# Altium schematic sheet Output1-12.SchDoc
size 594 x 420 mm; SheetNumber: 7; SheetTotal: 10; Обозначение документа: QFP output1-12; Номер листа: 7; Общее количество листов: 10
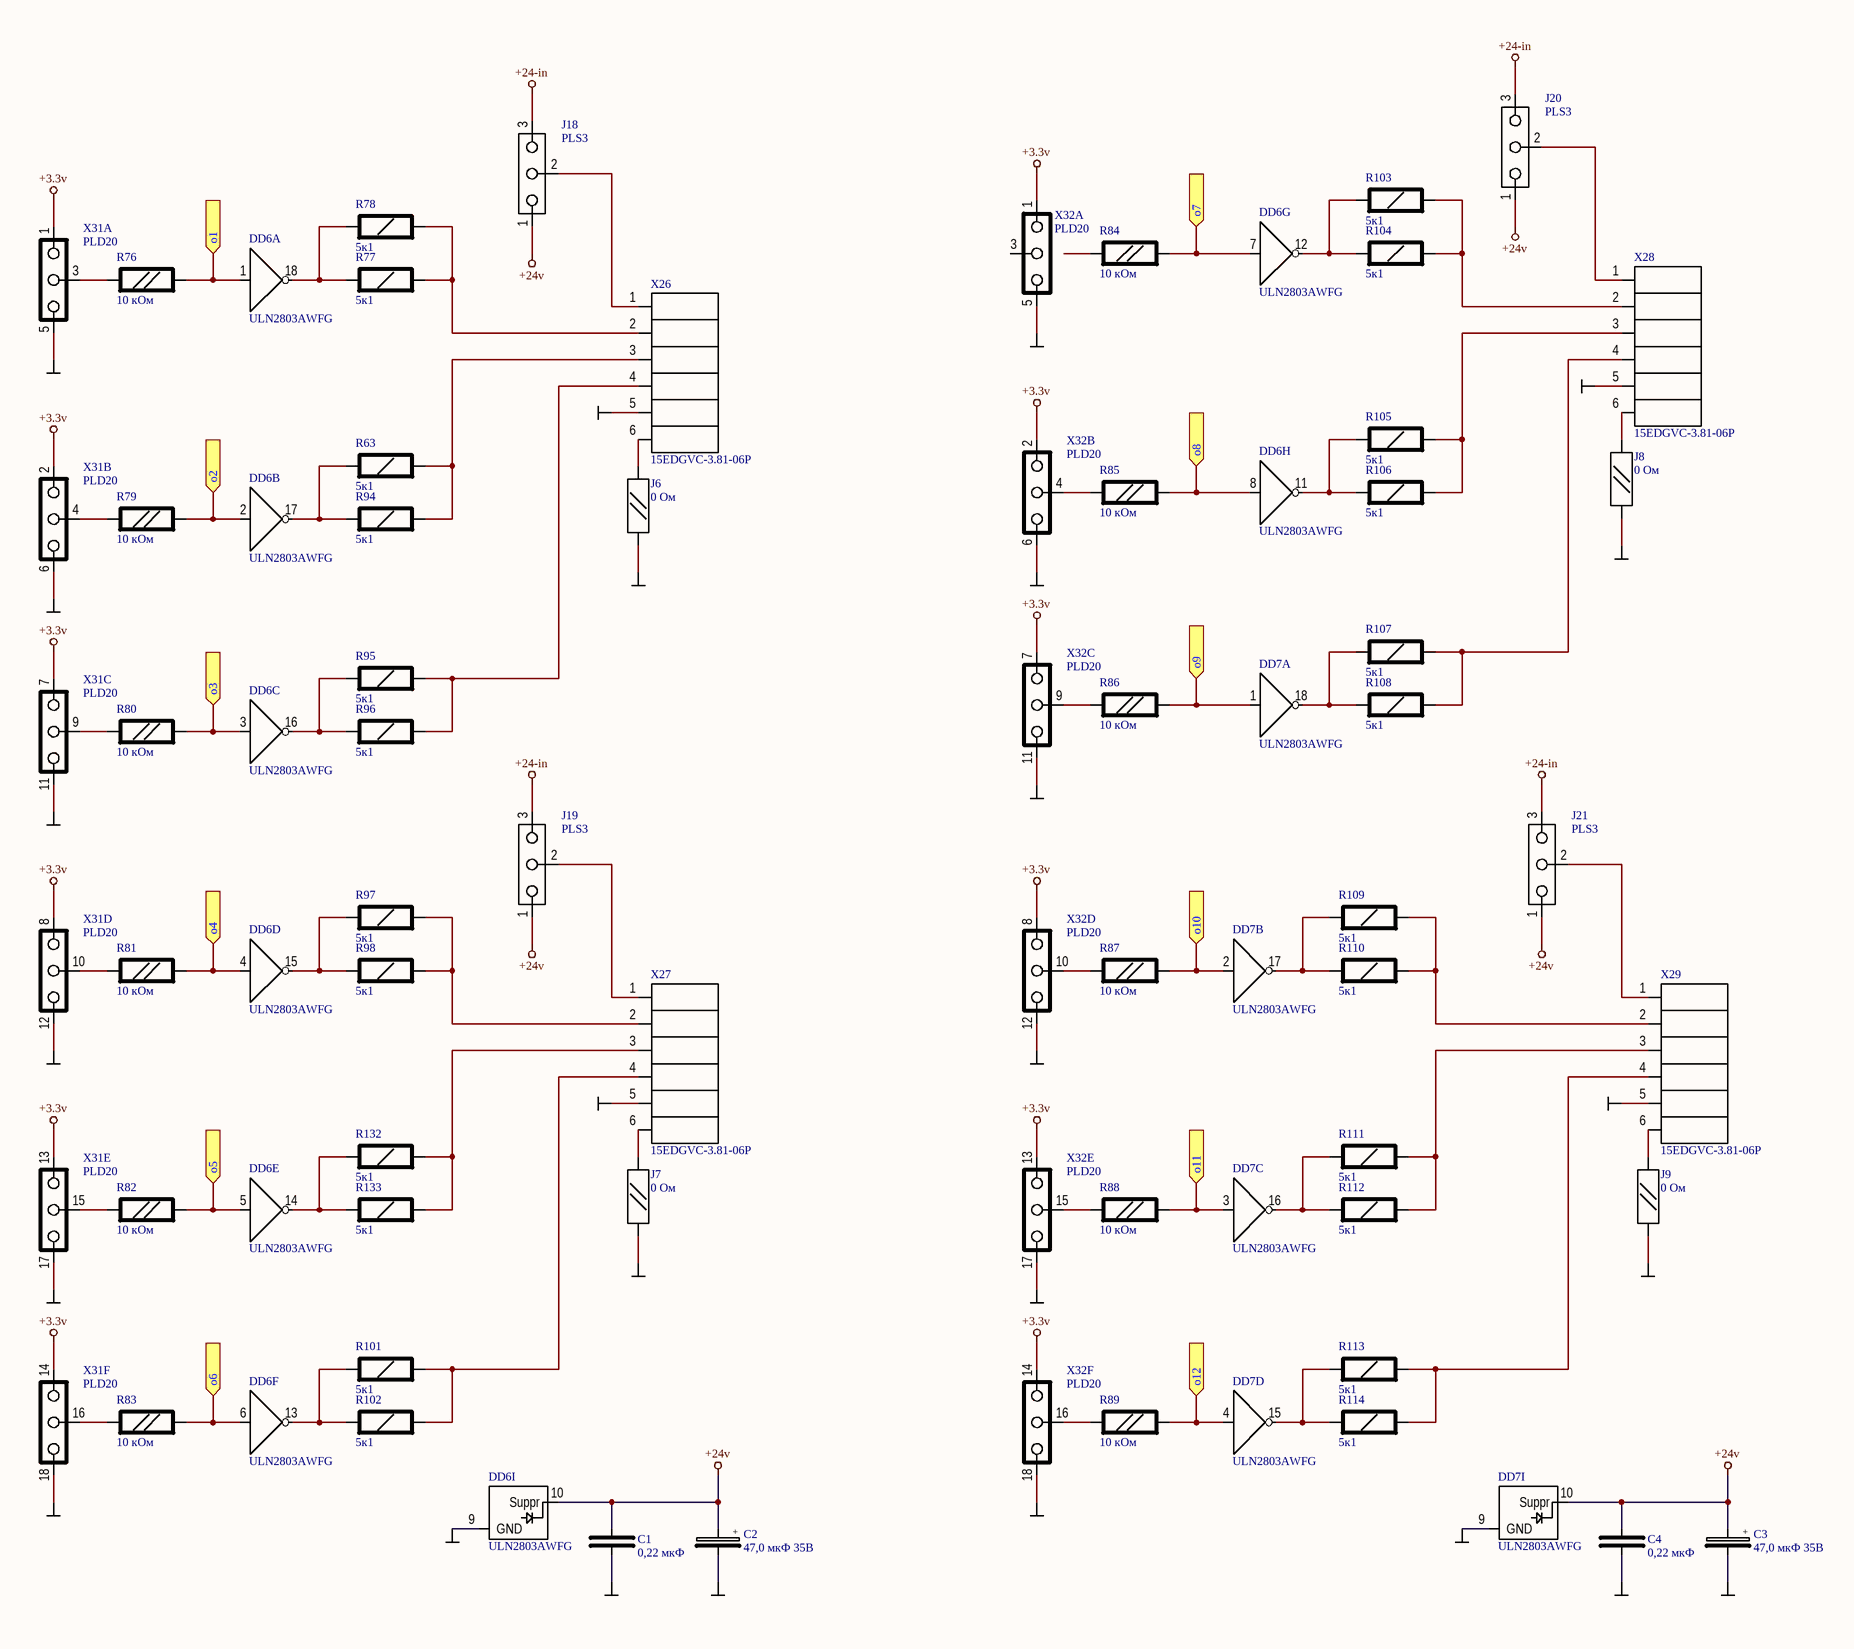
[diagram p0: Output1-12.SchDoc]

## Parts
C1  0,22 мкФ  [SMD0805CAP]
C2  47,0 мкФ 35В  [cap6]
C3  47,0 мкФ 35В  [cap6]
C4  0,22 мкФ  [SMD0805CAP]
DD6  ULN2803AWFG  [SOL18]  (parts A,B,C,D,E,F,G,H,I of 9)
DD7  ULN2803AWFG  [SOL18]  (parts A,B,C,D,I of 9)
J6  0 Ом  [SMD0805RES]
J7  0 Ом  [SMD0805RES]
J8  0 Ом  [SMD0805RES]
J9  0 Ом  [SMD0805RES]
J18  PLS3  [HDR1X3]
J19  PLS3  [HDR1X3]
J20  PLS3  [HDR1X3]
J21  PLS3  [HDR1X3]
R63  5к1  [RES1206]
R76  10 кОм  [SMD0805RES]
R77  5к1  [RES1206]
R78  5к1  [RES1206]
R79  10 кОм  [SMD0805RES]
R80  10 кОм  [SMD0805RES]
R81  10 кОм  [SMD0805RES]
R82  10 кОм  [SMD0805RES]
R83  10 кОм  [SMD0805RES]
R84  10 кОм  [SMD0805RES]
R85  10 кОм  [SMD0805RES]
R86  10 кОм  [SMD0805RES]
R87  10 кОм  [SMD0805RES]
R88  10 кОм  [SMD0805RES]
R89  10 кОм  [SMD0805RES]
R94  5к1  [RES1206]
R95  5к1  [RES1206]
R96  5к1  [RES1206]
R97  5к1  [RES1206]
R98  5к1  [RES1206]
R101  5к1  [RES1206]
R102  5к1  [RES1206]
R103  5к1  [RES1206]
R104  5к1  [RES1206]
R105  5к1  [RES1206]
R106  5к1  [RES1206]
R107  5к1  [RES1206]
R108  5к1  [RES1206]
R109  5к1  [RES1206]
R110  5к1  [RES1206]
R111  5к1  [RES1206]
R112  5к1  [RES1206]
R113  5к1  [RES1206]
R114  5к1  [RES1206]
R132  5к1  [RES1206]
R133  5к1  [RES1206]
X26  15EDGVC-3.81-06P  [15EDGVC_081_6]
X27  15EDGVC-3.81-06P  [15EDGVC_081_6]
X28  15EDGVC-3.81-06P  [15EDGVC_081_6]
X29  15EDGVC-3.81-06P  [15EDGVC_081_6]
X31  PLD20  [pld2x10_1.27]  (parts A,B,C,D,E,F of 7)
X32  PLD20  [pld2x10_1.27]  (parts A,B,C,D,E,F of 7)

## Ports
o1 (in), o2 (in), o3 (in), o4 (in), o5 (in), o6 (in), o7 (in), o8 (in), o9 (in), o10 (in), o11 (in), o12 (in)

## Nets
+3.3v: X31.1 X31.2 X31.7 X31.8 X31.13 X31.14 X32.1 X32.2 X32.7 X32.8 X32.13 X32.14
+24-in: J18.3(Left) J19.3(Left) J20.3(Left) J21.3(Left)
+24v: C1.1 C2.1(+) C3.1(+) C4.1 DD6.10(Suppr) DD7.10(Suppr) J18.1(Right) J19.1(Right) J20.1(Right) J21.1(Right)
GND: C1.2 C2.2(-) C3.2(-) C4.2 DD6.9(GND) DD7.9(GND) J6.2 J7.2 J8.2 J9.2 X26.5 X27.5 X28.5 X29.5 X31.5 X31.6 X31.11 X31.12 X31.17 X31.18 X32.5 X32.6 X32.11 X32.12 X32.17 X32.18
o1: DD6.1(In) R76.1 ; port o1
o2: DD6.2(In) R79.1 ; port o2
o3: DD6.3(In) R80.1 ; port o3
o4: DD6.4(In) R81.1 ; port o4
o5: DD6.5(In) R82.1 ; port o5
o6: DD6.6(In) R83.1 ; port o6
o7: DD6.7(In) R84.1 ; port o7
o8: DD6.8(In) R85.1 ; port o8
o9: DD7.1(In) R86.1 ; port o9
o10: DD7.2(In) R87.1 ; port o10
o11: DD7.3(In) R88.1 ; port o11
o12: DD7.4(In) R89.1 ; port o12
NetDD6_11: DD6.11(OUT) R105.2 R106.2
NetDD6_12: DD6.12(OUT) R103.2 R104.2
NetDD6_13: DD6.13(OUT) R101.2 R102.2
NetDD6_14: DD6.14(OUT) R132.2 R133.2
NetDD6_15: DD6.15(OUT) R97.2 R98.2
NetDD6_16: DD6.16(OUT) R95.2 R96.2
NetDD6_17: DD6.17(OUT) R63.2 R94.2
NetDD6_18: DD6.18(OUT) R77.2 R78.2
NetDD7_15: DD7.15(OUT) R113.2 R114.2
NetDD7_16: DD7.16(OUT) R111.2 R112.2
NetDD7_17: DD7.17(OUT) R109.2 R110.2
NetDD7_18: DD7.18(OUT) R107.2 R108.2
NetJ6_1: J6.1 X26.6
NetJ7_1: J7.1 X27.6
NetJ8_1: J8.1 X28.6
NetJ9_1: J9.1 X29.6
NetJ18_2: J18.2(Cetnter) X26.1
NetJ19_2: J19.2(Cetnter) X27.1
NetJ20_2: J20.2(Cetnter) X28.1
NetJ21_2: J21.2(Cetnter) X29.1
NetR63_1: R63.1 R94.1 X26.3
NetR76_2: R76.2 X31.3
NetR77_1: R77.1 R78.1 X26.2
NetR79_2: R79.2 X31.4
NetR80_2: R80.2 X31.9
NetR81_2: R81.2 X31.10
NetR82_2: R82.2 X31.15
NetR83_2: R83.2 X31.16
NetR85_2: R85.2 X32.4
NetR86_2: R86.2 X32.9
NetR87_2: R87.2 X32.10
NetR88_2: R88.2 X32.15
NetR89_2: R89.2 X32.16
NetR95_1: R95.1 R96.1 X26.4
NetR97_1: R97.1 R98.1 X27.2
NetR101_1: R101.1 R102.1 X27.4
NetR103_1: R103.1 R104.1 X28.2
NetR105_1: R105.1 R106.1 X28.3
NetR107_1: R107.1 R108.1 X28.4
NetR109_1: R109.1 R110.1 X29.2
NetR111_1: R111.1 R112.1 X29.3
NetR113_1: R113.1 R114.1 X29.4
NetR132_1: R132.1 R133.1 X27.3

Not connected (* = marked no-connect by the designer): R84 2; X32 3

## Notes on the sheet
- Подп. и дата
- Инв. № дубл.
- Взам. инв. №
- Инв. № подл.
- Изм.
- Лист
- № докум.
- Подп.
- Дата
- Копировал
- Формат А2

## Library data of the parts
C1 C4 = C0805: Чип конденсатор 0805; Voltage: 50V; Vendor: Generic; Temp: Y5V; Tol: 20%; SolderOpton: Norm; Value: 0,22 мкФ; Price: 2
C2 C3 = C_e: 5мм Электролитический конденсатор; SolderOption: Norm; Value: 47,0 мкФ 35В
DD6 DD7 = ULN2803: Буфер 8-канальный; Vendor: Toshiba; Voltage: 50V; Bandwidth: 15MHz; SolderOption: Norm; Value: ULN2803AWFG; Price: 100
J6-J9 = JR0805: SMD 0805 перемычка; SolderOption: Norm; Price: 2; Vendor: *; Value: 0 Ом
J18-J21 = PLS3: Джампер PLS3 2.54мм; SolderOption: Norm; Price: 1; Vendor: *; Value: PLS3
R63 R77 R78 R94-R98 R101-R114 R132 R133 = R1206: Чип резистор 1206; Vendor: Generic; Tolerance: 5%; SolderOpton: Norm; Price: 2; Value: 5к1
R76 R79-R89 = R0805: Чип резистор 0805; Vendor: Generic; Tolerance: 5%; SolderOpton: Norm; Price: 2; Value: 10 кОм
X26-X29 = 15EDGVC-3.81-06P: Вилка  6/3.81; Vendor: Degson; Current: 8А; Voltage: 2кВ; Price: 50; Value: 15EDGVC-3.81-06P
X31 X32 = PLD20: Вилка  PLD 20/1.27; Vendor: Confly; SolderOption: Norm; Price: 10; Value: PLD20